# EAGLE design boardpowersupply (EAGLE 7.5.0)
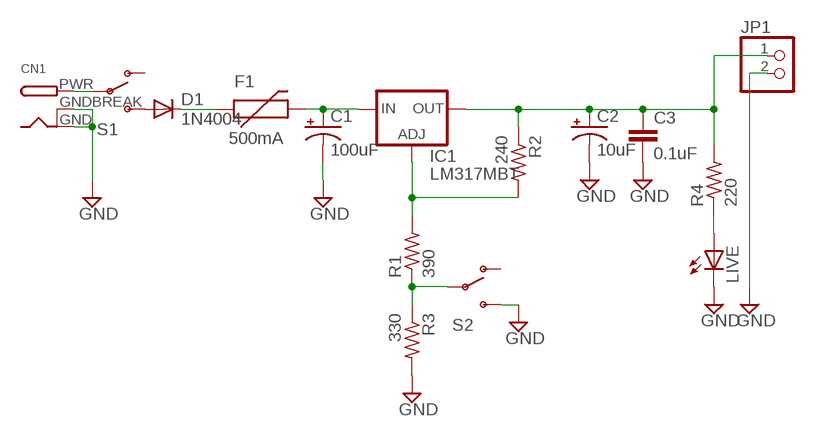
[diagram p0: schematic, sheet 1]

## Parts
C1  100uF  CPOL-USB45181A  [B45181A]
C2  10uF  CPOL-USB45181A  [B45181A]
C3  0.1uF  C2.5/2  [C2.5-2]
CN1  DCBARRELPTH  [DCJACK_2MM_PTH]
D1  1N4004  [DO41-10]
F1  500mA  PTCPTH  [PTC]
IC1  LM317MBT  [TO220L1]
JP1  PINHD-1X2  [1X02]
LIVE  LED5MM  [LED5MM]
R1  390  R-US_0204/7  [0204/7]
R2  240  R-US_0204/7  [0204/7]
R3  330  R-US_0204/7  [0204/7]
R4  220  R-US_0204/7  [0204/7]
S1  SWITCH-SPDTKIT  [SWITCH-SPDT_KIT]
S2  SWITCH-SPDTKIT  [SWITCH-SPDT_KIT]

## Nets
GND: C1.- C2.- C3.2 CN1.GND CN1.GNDBREAK JP1.2 LIVE.K(C) R3.2 S2.3(S)
N$1: D1.C F1.P$1
N$2: C1.+ F1.P$2 IC1.3(IN)
N$3: D1.A S1.3(S)
N$4: R1.1 R3.1 S2.2(P)
N$5: IC1.1(ADJ) R1.2 R2.2
N$6: LIVE.A R4.1
N$7: C2.+ C3.1 IC1.2(OUT) JP1.1 R2.1 R4.2
N$9: CN1.PWR S1.2(P)
Unconnected: S1.1(O) S2.1(O)

## Library data of the parts
C1 C2 = adafruit:CPOL-US: POLARIZED CAPACITOR, American symbol
C3 = capacitor-wima:C: CAPACITOR naming: grid - package width
CN1 = adafruit:DCBARREL: 2.0mm DC Barrel Jack DCJACK_2MM_PTH - Through Hole Jack (4UConnector: 05537)
D1 = adafruit:1N4004: DIODE General purpose 1N400x type rectifier (With bigger pads) http://www.ladyada.net/library/pcb/eaglelibrary.html
F1 = SparkFun-PowerIC:PTC: Resettable Fuse PTC Resettable Fuse. Spark Fun Electronics SKU : COM-08357
IC1 = v-reg:LM317?*: 500 mA Adjustable Output Positive Voltage Regulator Source: http://www.onsemi.co.jp .. LM317M-D.PDF
JP1 = pinhead:PINHD-1X2: PIN HEADER
LIVE = adafruit:LED: LED OSRAM: - CHIPLED LG R971, LG N971, LY N971, LG Q971, LY Q971, LO R971, LY R971 LH N974, LH R974 LS Q976, LO Q976, LY Q976 LO Q996 - Hyper CHIPLED LW Q18S LB Q993, LB Q99A, LB R99A - SideLED LS A670, LO A670, LY A670, LG A670, LP A670 LB A673, LV A673, LT A673, LW A673 LH A674 LY A675 LS A676, LA A676, LO A676, LY A676, LW A676 LS A679, LY A679, LG A679 - Hyper Micro SIDELED® LS Y876, LA Y876, LO Y876, LY Y876 LT Y87S - SmartLED LW L88C, LW L88S LB L89C, LB L89S, LG L890 LS L89K, LO L89K, LY L89K LS L896, LA L896, LO L896, LY L896 - TOPLED LS T670, LO T670, LY T670, LG T670, LP T670 LSG T670, LSP T670, LSY T670, LOP T670, LYG T670 LG T671, LOG T671, LSG T671 LB T673, LV T673, LT T673, LW T673 LH T674 LS T676, LA T676, LO T676, LY T676, LB T676, LH T676, LSB T676, LW T676 LB T67C, LV T67C, LT T67C, LS T67K, LO T67K, LY T67K, LW E67C LS E67B, LA E67B, LO E67B, LY E67B, LB E67C, LV E67C, LT E67C LW T67C LS T679, LY T679, LG T679 LS T770, LO T770, LY T770, LG T770, LP T770 LB T773, LV T773, LT T773, LW T773 LH T774 LS E675, LA E675, LY E675, LS T675 LS T776, LA T776, LO T776, LY T776, LB T776 LHGB T686 LT T68C, LB T68C - Hyper Mini TOPLED® LB M676 - Mini TOPLED Santana® LG M470 LS M47K, LO M47K, LY M47K Source: http://www.osram.convergy.de/
R1-R4 = resistor:R-US_: RESISTOR, American symbol
S1 S2 = SparkFun-Electromechanical:SWITCH-SPDT: SPDT Switch Simple slide switch, Spark Fun Electronics SKU : COM-00102 DPDT SMT slide switch, AYZ0202, SWCH-08179; PROD_ID: SWCH-08261

## Board
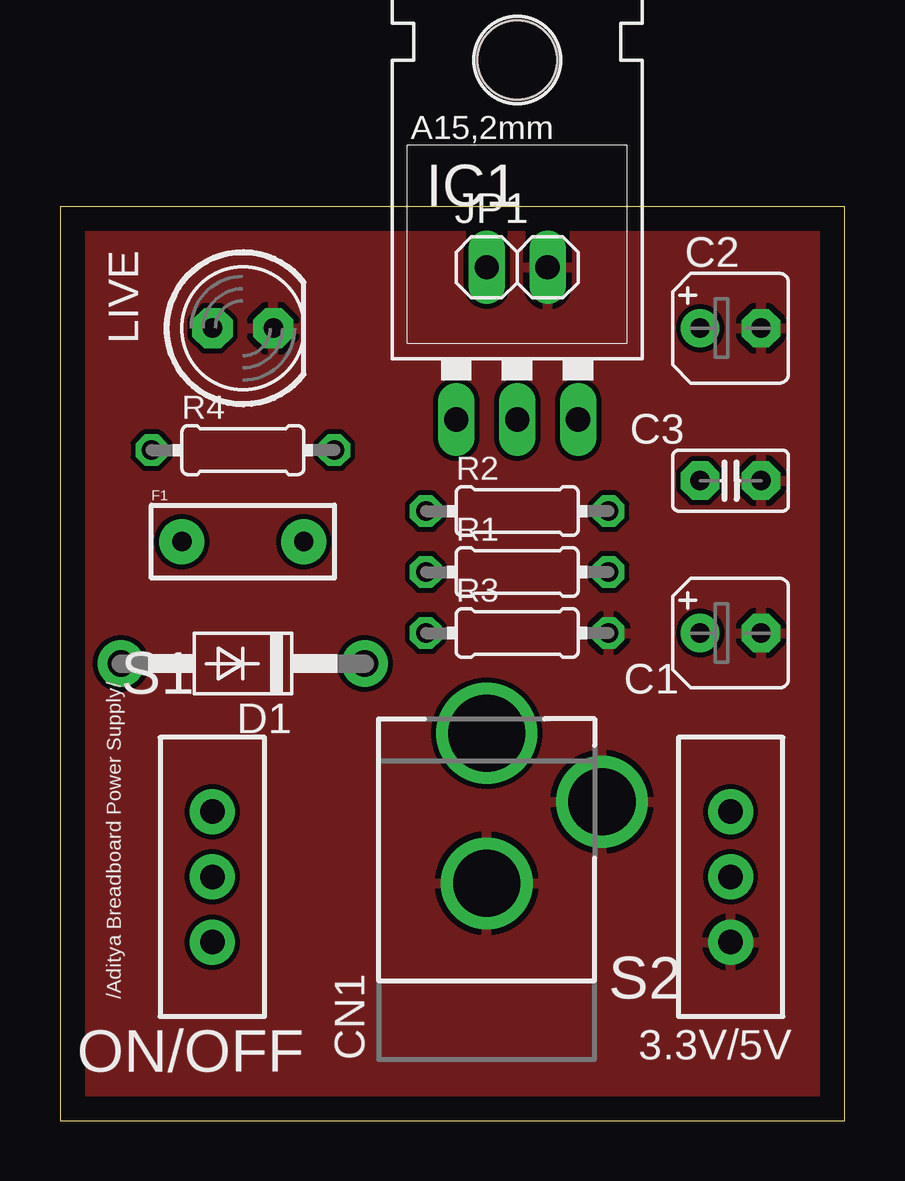
[diagram p1: board, top side]
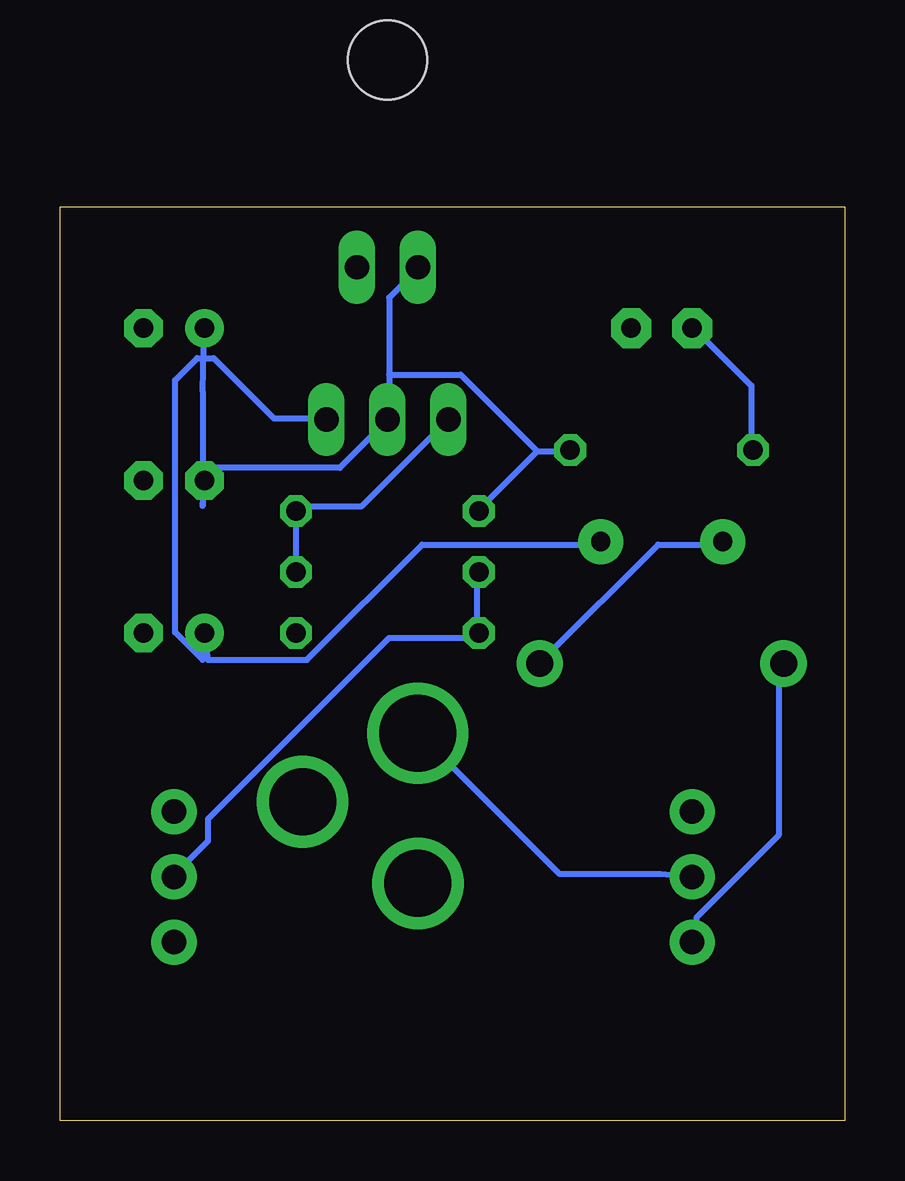
[diagram p2: board, bottom side, seen from below]

Size 32.69 x 38.09 mm. Coordinates in mm from the lower left corner, seen from the top.
Outline: 0,0 32.69,0 32.69,38.09 0,38.09 0,0
Copper layers (1*16): Top 0.035mm / dielectric 1.5mm / Bottom 0.035mm
Design rules "default": minimum track width 10mil, minimum drill 24mil, track to track 8mil, track to pad 8mil, pad to pad 8mil, via to via 8mil, smd to smd 8mil, copper to edge 40mil, drill to drill 8mil, minimum pad ring 10mil, minimum via ring 8mil, stop-mask expansion 4mil, vias tented up to drill 0mil, thermal gap 10mil

### Footprints (pad centres in the part's own frame; a part is rotated, then mirrored left to right if it is on the bottom)
B45181A = drill 0.813 pad 1.6: + -1.27,0 | drill 0.813 pad 1.6 octagon: - 1.27,0
C2.5-2 = drill 0.813 pad 1.6 octagon: 1 -1.27,0; 2 1.27,0
DCJACK_2MM_PTH = drill 2.8: GND 0,7.35; GNDBREAK 4.8,10.75 | drill 3.2: PWR 0,13.6
DO41-10 = drill 1.118 pad 1.93: A 5.08,0; C -5.08,0
PTC = drill 0.8 pad 1.88: P$1 -2.54,0; P$2 2.54,0
TO220L1 = drill 1.016 long: 1 -2.54,-3.81; 2 0,-3.81; 3 2.54,-3.81 | hole 3.302: 0,11.176
1X02 = drill 1.016 long: 1 -1.27,0; 2 1.27,0
LED5MM = drill 0.813 pad 1.676 octagon: A -1.27,0; K 1.27,0
0204/7 = drill 0.813 octagon: 1 -3.81,0; 2 3.81,0
SWITCH-SPDT_KIT = drill 1.016 pad 1.88: 1 0,2.718; 2 0,0; 3 0,-2.718

### Placement (x,y rotation side)
C1  27.94,20.32 0 top
C2  27.94,33.02 0 top
C3  27.94,26.67 0 top
CN1  17.78,2.54 0 top
D1  7.62,19.05 180 top
F1  7.62,24.13 0 top
IC1  19.05,33.02 0 top
JP1  19.05,35.56 0 top
LIVE  7.62,33.02 0 top
R1  19.05,22.86 0 top
R2  19.05,25.4 0 top
R3  19.05,20.32 0 top
R4  7.62,27.94 0 top
S1  6.35,10.16 0 top
S2  27.94,10.16 0 top

### Tracks (layer width: path | path; a pad name or v marks a point on that pad's centre or on a via)
GND
  pour Top: 0,38.1 0,0 33.02,0 33.02,38.1
N$1
  Bottom 0.254: F1.P$1 5.26,24 7.77,24 12.57,19.2 D1.C
N$2
  Bottom 0.254: IC1.3 21.72,29.26 23.77,29.26 26.29,31.77 26.98,31.77 27.89,30.86 27.89,20.34 26.75,19.2 C1.+ 26.52,19.2 22.4,19.2 17.6,24 10.29,24 F1.P$2
N$3
  Bottom 0.254: S1.3 6.17,7.54 6.17,8.46 2.74,11.89 2.74,18.97 D1.A
N$4
  Bottom 0.254: R1.1 15.32,22.86 15.32,20.34 R3.1 15.32,20.12 18.97,20.12 26.52,12.57 26.52,11.66 27.89,10.29 S2.2
N$5
  Bottom 0.254: R1.2 R2.2 22.86,25.6 20.12,25.6 IC1.1
N$6
  Bottom 0.254: R4.1 3.89,28.12 3.89,30.63 6.17,32.92 LIVE.A
N$7
  Bottom 0.254: 26.75,27.2 26.75,30.4 C2.+ | 26.75,27.2 26.75,25.6 C3.1 | 12.8,27.89 11.43,27.89 R4.2 | 12.8,27.89 15.09,25.6 R2.1 | 18.97,31.09 18.97,34.29 17.83,35.43 JP1.1 | 18.97,31.09 18.97,29.26 IC1.2 19.2,29.03 21.03,27.2 26.75,27.2 | 12.8,27.89 16,31.09 18.97,31.09
N$9
  Bottom 0.254: S1.2 7.67,10.29 11.89,10.29 17.6,16 CN1.PWR

### Text on the board
tPlace: /Aditya Breadboard Power Supply/ | ON/OFF | 3.3V/5V